# EAGLE design 32u4_macropad (EAGLE 9.6.2)
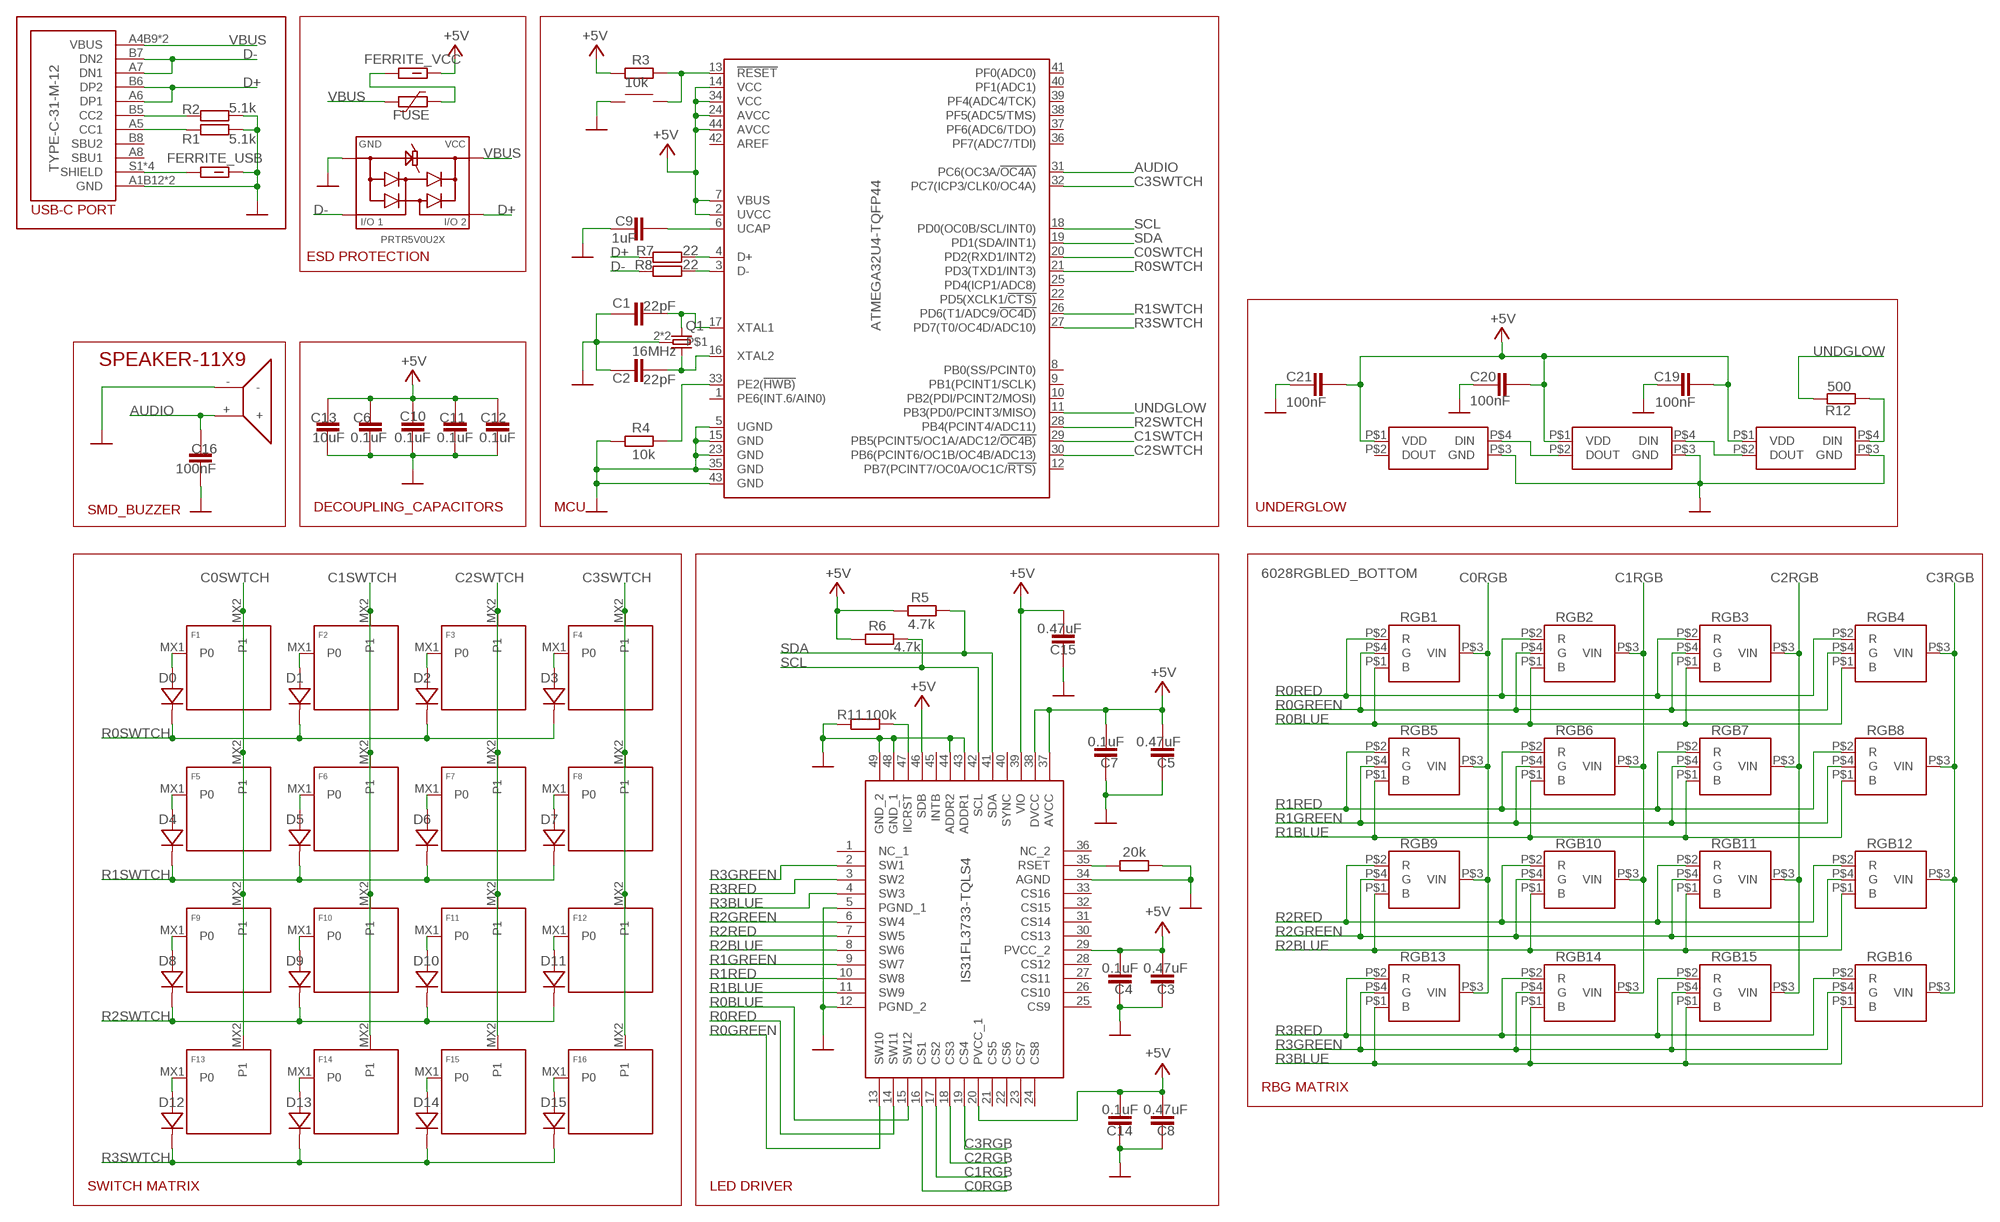
[diagram p0: schematic, sheet 1]

## Parts
C1  22pF  CAPACITOR-0603  [C0603]
C2  22pF  CAPACITOR-0603  [C0603]
C3  0.47uF  CAPACITOR-0603  [C0603]
C4  0.1uF  CAPACITOR-0603  [C0603]
C5  0.47uF  CAPACITOR-0603  [C0603]
C6  0.1uF  CAPACITOR-0603  [C0603]
C7  0.1uF  CAPACITOR-0603  [C0603]
C8  0.47uF  CAPACITOR-0603  [C0603]
C9  1uF  CAPACITOR-0603  [C0603]
C10  0.1uF  CAPACITOR-0603  [C0603]
C11  0.1uF  CAPACITOR-0603  [C0603]
C12  0.1uF  CAPACITOR-0603  [C0603]
C13  10uF  CAPACITOR-0603  [C0603]
C14  0.1uF  CAPACITOR-0603  [C0603]
C15  0.47uF  CAPACITOR-0603  [C0603]
C16  100nF  CAPACITOR-0603  [C0603]
C19  100nF  CAPACITOR-0603  [C0603]
C20  100nF  CAPACITOR-0603  [C0603]
C21  100nF  CAPACITOR-0603  [C0603]
D0  DIODE-SOD-123  [SOD-123]
D1  DIODE-SOD-123  [SOD-123]
D2  DIODE-SOD-123  [SOD-123]
D3  DIODE-SOD-123  [SOD-123]
D4  DIODE-SOD-123  [SOD-123]
D5  DIODE-SOD-123  [SOD-123]
D6  DIODE-SOD-123  [SOD-123]
D7  DIODE-SOD-123  [SOD-123]
D8  DIODE-SOD-123  [SOD-123]
D9  DIODE-SOD-123  [SOD-123]
D10  DIODE-SOD-123  [SOD-123]
D11  DIODE-SOD-123  [SOD-123]
D12  DIODE-SOD-123  [SOD-123]
D13  DIODE-SOD-123  [SOD-123]
D14  DIODE-SOD-123  [SOD-123]
D15  DIODE-SOD-123  [SOD-123]
DRIVER  IS31FL3733-TQLS4  [QFP50P900X900X120-49N]
F1  KEYSWITCH-PLAIN-MX-1U  [MX-1U]
F2  KEYSWITCH-PLAIN-MX-1U  [MX-1U]
F3  KEYSWITCH-PLAIN-MX-1U  [MX-1U]
F4  KEYSWITCH-PLAIN-MX-1U  [MX-1U]
F5  KEYSWITCH-PLAIN-MX-1U  [MX-1U]
F6  KEYSWITCH-PLAIN-MX-1U  [MX-1U]
F7  KEYSWITCH-PLAIN-MX-1U  [MX-1U]
F8  KEYSWITCH-PLAIN-MX-1U  [MX-1U]
F9  KEYSWITCH-PLAIN-MX-1U  [MX-1U]
F10  KEYSWITCH-PLAIN-MX-1U  [MX-1U]
F11  KEYSWITCH-PLAIN-MX-1U  [MX-1U]
F12  KEYSWITCH-PLAIN-MX-1U  [MX-1U]
F13  KEYSWITCH-PLAIN-MX-1U  [MX-1U]
F14  KEYSWITCH-PLAIN-MX-1U  [MX-1U]
F15  KEYSWITCH-PLAIN-MX-1U  [MX-1U]
F16  KEYSWITCH-PLAIN-MX-1U  [MX-1U]
FERRITE_USB  FERRITE_BEAD  FBCHIP-0603(1608-METRIC)  [BEADC1608X95N]
FERRITE_VCC  FERRITE_BEAD  FBCHIP-0603(1608-METRIC)  [BEADC1608X95N]
FUSE  0603L050  [0603L]
J1  TYPE-C-31-M-12  [HRO_TYPE-C-31-M-12]
MCU  ATMEGA32U4-TQFP44  MCU-ATMEGA32U4-AU(TQFP44)  [TQFP44-0.8-9.6X9.6MM]
Q1  16MHz  KX-5  [2.0X1.6_KX-5]
R1  5.1k  RESISTOR-0603  [R0603]
R2  5.1k  RESISTOR-0603  [R0603]
R3  10k  RESISTOR-0603  [R0603]
R4  10k  RESISTOR-0603  [R0603]
R5  4.7k  RESISTOR-0603  [R0603]
R6  4.7k  RESISTOR-0603  [R0603]
R7  22  RESISTOR-0603  [R0603]
R8  22  RESISTOR-0603  [R0603]
R11  100k  RESISTOR-0603  [R0603]
R12  500  RESISTOR-0603  [R0603]
RESET  20k  RESISTOR-0603  [R0603]
RGB1  6028RGBLED_BOTTOM  [6028RGBLED_BOTTOM]
RGB2  6028RGBLED_BOTTOM  [6028RGBLED_BOTTOM]
RGB3  6028RGBLED_BOTTOM  [6028RGBLED_BOTTOM]
RGB4  6028RGBLED_BOTTOM  [6028RGBLED_BOTTOM]
RGB5  6028RGBLED_BOTTOM  [6028RGBLED_BOTTOM]
RGB6  6028RGBLED_BOTTOM  [6028RGBLED_BOTTOM]
RGB7  6028RGBLED_BOTTOM  [6028RGBLED_BOTTOM]
RGB8  6028RGBLED_BOTTOM  [6028RGBLED_BOTTOM]
RGB9  6028RGBLED_BOTTOM  [6028RGBLED_BOTTOM]
RGB10  6028RGBLED_BOTTOM  [6028RGBLED_BOTTOM]
RGB11  6028RGBLED_BOTTOM  [6028RGBLED_BOTTOM]
RGB12  6028RGBLED_BOTTOM  [6028RGBLED_BOTTOM]
RGB13  6028RGBLED_BOTTOM  [6028RGBLED_BOTTOM]
RGB14  6028RGBLED_BOTTOM  [6028RGBLED_BOTTOM]
RGB15  6028RGBLED_BOTTOM  [6028RGBLED_BOTTOM]
RGB16  6028RGBLED_BOTTOM  [6028RGBLED_BOTTOM]
SP1  SPEAKER-11X9  SPEAKER-SMD-11X9  [AST1109MLTRQ]
SW2  SWITCH-SMD-EVP-BB2A9B00  [SWITCH-SMD-EVP-BB2A9B00]
U$1  PRTR5V0U2X  [PRTR5V0U2X]
UGLOW1  SK6812MINI-E  [SK6812MINI-E]
UGLOW2  SK6812MINI-E  [SK6812MINI-E]
UGLOW3  SK6812MINI-E  [SK6812MINI-E]

## Nets
AUDIO: C16.1 MCU.31(PC6(OC3A/!OC4A)) SP1.+
C0RGB: DRIVER.16(CS1) RGB1.P$3(VIN) RGB5.P$3(VIN) RGB9.P$3(VIN) RGB13.P$3(VIN)
C0SWTCH: F1.MX2(P1) F5.MX2(P1) F9.MX2(P1) F13.MX2(P1) MCU.20(PD2(RXD1/INT2))
C1RGB: DRIVER.17(CS2) RGB2.P$3(VIN) RGB6.P$3(VIN) RGB10.P$3(VIN) RGB14.P$3(VIN)
C1SWTCH: F2.MX2(P1) F6.MX2(P1) F10.MX2(P1) F14.MX2(P1) MCU.29(PB5(PCINT5/OC1A/ADC12/!OC4B))
C2RGB: DRIVER.18(CS3) RGB3.P$3(VIN) RGB7.P$3(VIN) RGB11.P$3(VIN) RGB15.P$3(VIN)
C2SWTCH: F3.MX2(P1) F7.MX2(P1) F11.MX2(P1) F15.MX2(P1) MCU.30(PB6(PCINT6/OC1B/OC4B/ADC13))
C3RGB: DRIVER.19(CS4) RGB4.P$3(VIN) RGB8.P$3(VIN) RGB12.P$3(VIN) RGB16.P$3(VIN)
C3SWTCH: F4.MX2(P1) F8.MX2(P1) F12.MX2(P1) F16.MX2(P1) MCU.32(PC7(ICP3/CLK0/OC4A))
D+: J1.A6(DP1) J1.B6(DP2) R7.1 U$1.3
D-: J1.A7(DN1) J1.B7(DN2) R8.1 U$1.2
GND: C1.1 C2.1 C3.1 C4.1 C5.1 C6.2 C7.1 C8.1 C9.1 C10.2 C11.2 C12.2 C13.2 C14.1 C15.1 C16.2 C19.1 C20.1 C21.1 DRIVER.5(PGND_1) DRIVER.12(PGND_2) DRIVER.34(AGND) DRIVER.43(ADDR1) DRIVER.44(ADDR2) DRIVER.48(GND_1) DRIVER.49(GND_2) FERRITE_USB.2 J1.A1B12(GND) J1.B1A12(GND) MCU.5(UGND) MCU.15(GND) MCU.23(GND) MCU.35(GND) MCU.43(GND) Q1.2 Q1.4 R1.1 R2.1 R4.1 R11.1 RESET.2 SP1.- SW2.A@1 SW2.A@2 U$1.1 UGLOW1.P$3(GND) UGLOW2.P$3(GND) UGLOW3.P$3(GND)
N$1: D0.A F1.MX1(P0)
N$2: FERRITE_VCC.1 FUSE.1
N$3: D1.A F2.MX1(P0)
N$4: D2.A F3.MX1(P0)
N$5: C2.2 MCU.16(XTAL2) Q1.3
N$6: MCU.3(D-) R8.2
N$7: R12.1 UGLOW3.P$4(DIN)
N$8: MCU.33(PE2(!HWB)) R4.2
N$9: D4.A F5.MX1(P0)
N$10: DRIVER.47(IICRST) R11.2
N$11: D5.A F6.MX1(P0)
N$12: D6.A F7.MX1(P0)
N$13: D9.A F10.MX1(P0)
N$15: MCU.4(D+) R7.2
N$17: MCU.13(!RESET) R3.2 SW2.B@3 SW2.B@4
N$20: C9.2 MCU.6(UCAP)
N$21: C1.2 MCU.17(XTAL1) Q1.1
N$23: D10.A F11.MX1(P0)
N$24: FERRITE_USB.1 J1.A5(CC1) J1.B5(CC2) J1.S1(SHIELD) J1.S2(SHIELD) J1.S3(SHIELD) J1.S4(SHIELD) R1.2 R2.2
N$25: UGLOW1.P$4(DIN) UGLOW2.P$2(DOUT)
N$26: DRIVER.35(RSET) RESET.1
N$28: D3.A F4.MX1(P0)
N$29: D7.A F8.MX1(P0)
N$30: D11.A F12.MX1(P0)
N$31: D13.A F14.MX1(P0)
N$32: D14.A F15.MX1(P0)
N$33: D12.A F13.MX1(P0)
N$34: D15.A F16.MX1(P0)
N$38: D8.A F9.MX1(P0)
N$39: UGLOW2.P$4(DIN) UGLOW3.P$2(DOUT)
R0BLUE: DRIVER.15(SW12) RGB1.P$1(B) RGB2.P$1(B) RGB3.P$1(B) RGB4.P$1(B)
R0GREEN: DRIVER.13(SW10) RGB1.P$4(G) RGB2.P$4(G) RGB3.P$4(G) RGB4.P$4(G)
R0RED: DRIVER.14(SW11) RGB1.P$2(R) RGB2.P$2(R) RGB3.P$2(R) RGB4.P$2(R)
R0SWTCH: D0.C D1.C D2.C D3.C MCU.21(PD3(TXD1/INT3))
R1BLUE: DRIVER.11(SW9) RGB5.P$1(B) RGB6.P$1(B) RGB7.P$1(B) RGB8.P$1(B)
R1GREEN: DRIVER.9(SW7) RGB5.P$4(G) RGB6.P$4(G) RGB7.P$4(G) RGB8.P$4(G)
R1RED: DRIVER.10(SW8) RGB5.P$2(R) RGB6.P$2(R) RGB7.P$2(R) RGB8.P$2(R)
R1SWTCH: D4.C D5.C D6.C D7.C MCU.26(PD6(T1/ADC9/!OC4D))
R2BLUE: DRIVER.8(SW6) RGB9.P$1(B) RGB10.P$1(B) RGB11.P$1(B) RGB12.P$1(B)
R2GREEN: DRIVER.6(SW4) RGB9.P$4(G) RGB10.P$4(G) RGB11.P$4(G) RGB12.P$4(G)
R2RED: DRIVER.7(SW5) RGB9.P$2(R) RGB10.P$2(R) RGB11.P$2(R) RGB12.P$2(R)
R2SWTCH: D8.C D9.C D10.C D11.C MCU.28(PB4(PCINT4/ADC11))
R3BLUE: DRIVER.4(SW3) RGB13.P$1(B) RGB14.P$1(B) RGB15.P$1(B) RGB16.P$1(B)
R3GREEN: DRIVER.2(SW1) RGB13.P$4(G) RGB14.P$4(G) RGB15.P$4(G) RGB16.P$4(G)
R3RED: DRIVER.3(SW2) RGB13.P$2(R) RGB14.P$2(R) RGB15.P$2(R) RGB16.P$2(R)
R3SWTCH: D12.C D13.C D14.C D15.C MCU.27(PD7(T0/OC4D/ADC10))
SCL: DRIVER.42(SCL) MCU.18(PD0(OC0B/SCL/INT0)) R6.1
SDA: DRIVER.41(SDA) MCU.19(PD1(SDA/INT1)) R5.1
UNDGLOW: MCU.11(PB3(PD0/PCINT3/MISO)) R12.2
VBUS: FUSE.2 J1.A4B9(VBUS) J1.B4A9(VBUS) U$1.4
VCC: C3.2 C4.2 C5.2 C6.1 C7.2 C8.2 C10.1 C11.1 C12.1 C13.1 C14.2 C15.2 C19.2 C20.2 C21.2 DRIVER.20(PVCC_1) DRIVER.29(PVCC_2) DRIVER.37(AVCC) DRIVER.38(DVCC) DRIVER.39(VIO) DRIVER.46(SDB) FERRITE_VCC.2 MCU.2(UVCC) MCU.7(VBUS) MCU.14(VCC) MCU.24(AVCC) MCU.34(VCC) MCU.44(AVCC) R3.1 R5.2 R6.2 UGLOW1.P$1(VDD) UGLOW2.P$1(VDD) UGLOW3.P$1(VDD) ; supply symbol labelled +5V
Unconnected: DRIVER.1(NC_1) DRIVER.21(CS5) DRIVER.22(CS6) DRIVER.23(CS7) DRIVER.24(CS8) DRIVER.25(CS9) DRIVER.26(CS10) DRIVER.27(CS11) DRIVER.28(CS12) DRIVER.30(CS13) DRIVER.31(CS14) DRIVER.32(CS15) DRIVER.33(CS16) DRIVER.36(NC_2) DRIVER.40(SYNC) DRIVER.45(INTB) J1.A8(SBU1) J1.B8(SBU2) MCU.1(PE6(INT.6/AIN0)) MCU.8(PB0(SS/PCINT0)) MCU.9(PB1(PCINT1/SCLK)) MCU.10(PB2(PDI/PCINT2/MOSI)) MCU.12(PB7(PCINT7/OC0A/OC1C/!RTS)) MCU.22(PD5(XCLK1/!CTS)) MCU.25(PD4(ICP1/ADC8)) MCU.36(PF7(ADC7/TDI)) MCU.37(PF6(ADC6/TDO)) MCU.38(PF5(ADC5/TMS)) MCU.39(PF4(ADC4/TCK)) MCU.40(PF1(ADC1)) MCU.41(PF0(ADC0)) MCU.42(AREF) UGLOW1.P$2(DOUT)

## Notes on the sheet
- USB-C PORT
- ESD PROTECTION
- SMD_BUZZER | DECOUPLING_CAPACITORS | MCU | UNDERGLOW
- RBG MATRIX
- SWITCH MATRIX | LED DRIVER

## Library data of the parts
C1-C16 C19-C21 = Components:CAPACITOR
D0 D1-D15 = Components:DIODE: Standard 1N4148 diode
DRIVER = IS31FL3733-TQLS4:IS31FL3733-TQLS4: LED Display Drivers 12x16 Dot Matrix LED Driver, eTQFP-48 (7.0mm x 7.0mm), Tray Source: Datasheet <https://mouser.componentsearchengine.com/Datasheets/1/IS31FL3733-TQLS4.pdf>; DESCRIPTION: LED Display Drivers 12x16 Dot Matrix LED Driver, eTQFP-48 (7.0mm x 7.0mm), Tray; HEIGHT: 1.2mm; MANUFACTURER_NAME: Integrated Silicon Solution Inc.; MANUFACTURER_PART_NUMBER: IS31FL3733-TQLS4; MOUSER_PART_NUMBER: 870-IS31FL3733-TQLS4; MOUSER_PRICE-STOCK: https://www.mouser.com/Search/Refine.aspx?Keyword=870-IS31FL3733-TQLS4
F1-F16 = Keyboard:KEYSWITCH-PLAIN
FERRITE_USB FERRITE_VCC = Filter:FB: Ferrite Bead - Generic; CATEGORY: Filter; SUB-CATEGORY: Ferrite bead
FUSE = polyfuse-smd_20:?: Polyfuse Resettable PTC Source: http://www.littelfuse.com/products/resettable-ptcs.aspx; MF: Littelfuse; MPN: 0603L050; OC_FARNELL: 2125904; OC_NEWARK: 88T7683
J1 = TYPE-C-31-M-12:TYPE-C-31-M-12: USB Connectors 24 Receptacle 1 8.94*7.3mm RoHS; AVAILABILITY: Unavailable; DESCRIPTION: USB Connectors 24 Receptacle 1 8.94*7.3mm RoHS; MF: HRO Electronics Co., Ltd.; MP: TYPE-C-31-M-12; PACKAGE: Package; PRICE: None
MCU = OPL_IC:MCU-ATMEGA32U4-AU(TQFP44): 310010010; MPN: ATMEGA32U4
Q1 = crystal-geyer_V1_0_NIC:KX: Quartz Crystals (MHz) SMD: KX - Serie Model Size l/w/h [mm] Frequency Range Frequency Stability Temp. Range [°C] Load Capacitance AECQ 200 availabel Datasheet KX-4 KX-5 KX-6 KX-7 KX-9A KX-9B KX-12A KX-12B KX-13 KX-20 KX-K KX-KS 1.6/1.2/0.3 2.0/1.6/0.45 2.5/2.0/0.55 3.2/2.5/0.8 5.0/3.2/1.0 5.0/3.2/1.1 6.0/3.5/1.1 6.0/3.5/1.0 7.0/5.0 /1.3 11.6/5.5/1.6 12.3/4.5/4.2 12.3/4.5/3.2 24.0 ~ 80.0 MHz 16.0 ~ 80.0 MHz 12.0 ~ 80.0 MHz 8.0 ~ 60.0 MHz 7,68 ~ 300,0 MHz 8,0 ~ 50,0 MHz 8,0 ~ 150,0 MHz 8,0 ~ 50,0 MHz 6,0 ~ 160,0 MHz 3,579 ~ 25,0 MHz 3,579 ~ 70,0 MHz 3,579 ~ 70,0 MHz ±10 … ±50ppm ±10 … ±50ppm ±10 … ±50ppm ±10 … ±50ppm ±10 … ±50ppm ±10 … ±50ppm ±10 … ±50ppm ±10 … ±50ppm ±10 … ±50ppm ±50ppm ±10 … ±50ppm ±10 … ±50ppm (*) -40°C …+85°C (*) -40°C …+125°C (*) -40°C …+125°C (*) -40°C …+125°C (*) -40°C …+105°C (*) -40°C …+105°C (*) -40°C …+125°C (*) -40°C …+105°C (*) -40°C …+105°C (*) -40°C …+105°C (*) -40°C …+85°C (*) -40°C …+85°C 8, 8…16 8, 8…16 10, 8…16 12, 7…20 16, 10…20 16, 10…20 16, 10…20 16, 12…20 16, 12…20 16, 12…20 16, 12…30 16, 12…30 - yes yes yes - - - - - - - - KX-4.pdf <http://www.geyer-electronic.de/uploads/tx_userartikelfrequenz/GEYER-KX-4.pdf> KX-5.pdf <http://www.geyer-electronic.de/uploads/tx_userartikelfrequenz/GEYER-KX-5.pdf> KX-6.pdf <http://www.geyer-electronic.de/uploads/tx_userartikelfrequenz/GEYER-KX-6.pdf> KX-7.pdf <http://www.geyer-electronic.de/uploads/tx_userartikelfrequenz/GEYER-KX-7.pdf> KX-9A.pdf <http://www.geyer-electronic.de/uploads/tx_userartikelfrequenz/GEYER-KX-9A.pdf> KX-9B.pdf <http://www.geyer-electronic.de/uploads/tx_userartikelfrequenz/GEYER-KX-9B.pdf> KX-12A.pdf <http://www.geyer-electronic.de/uploads/tx_userartikelfrequenz/GEYER-KX-12A.pdf> KX-12B.pdf <http://www.geyer-electronic.de/uploads/tx_userartikelfrequenz/GEYER-KX-12B.pdf> KX-13.pdf <http://www.geyer-electronic.de/uploads/tx_userartikelfrequenz/GEYER-KX-13.pdf> KX-20.pdf <http://www.geyer-electronic.de/uploads/tx_userartikelfrequenz/GEYER-KX-20.pdf> KX-K.pdf <http://www.geyer-electronic.de/uploads/tx_userartikelfrequenz/GEYER-KX-K.pdf> KX-KS.pdf <http://www.geyer-electronic.de/uploads/tx_userartikelfrequenz/GEYER-KX-KS.pdf> <http://www.geyer-electronic.de/fileadmin/template/img/logo-geyer-electronic.png> Details see: http://www.geyer-electronic.de/Frequenz-Produkte.9.0.html Created 2016-06-07, Hans Locher 2016 (C) Geyer Quartz Technology KX4,KX5,KX6,KX7,KX9A,KX9B,KX12A,KX12B,KX13,KX20,KXK,KXKS;1612;2016;2520;3225;5032;6035;7050;11655;12345;1,6x1,2;2,0x1,6;2,5x2,0;3,2x2,5;5,0x3,2;6,0x3,5;7,0x5,0;11,6x5,5;12,3x4,5;12,3x4,5;1.6x1.2;2.0x1.6;2.5x2.0;3.2x2.5;5.0x3.2;6.0x3.5;7.0x5.0;11.6x5.5;12.3x4.5;12.3x4.5;
R1-R8 R11 R12 RESET = Components:RESISTOR
RGB1-RGB16 = 6028LED:6028RGBLED
SP1 = Controller:SPEAKER
SW2 = Controller:SWITCH-SMD
U$1 = Controller:PRTR5V0U2X
UGLOW1-UGLOW3 = SK6812MINI-E:SK6812MINI-E

## Board
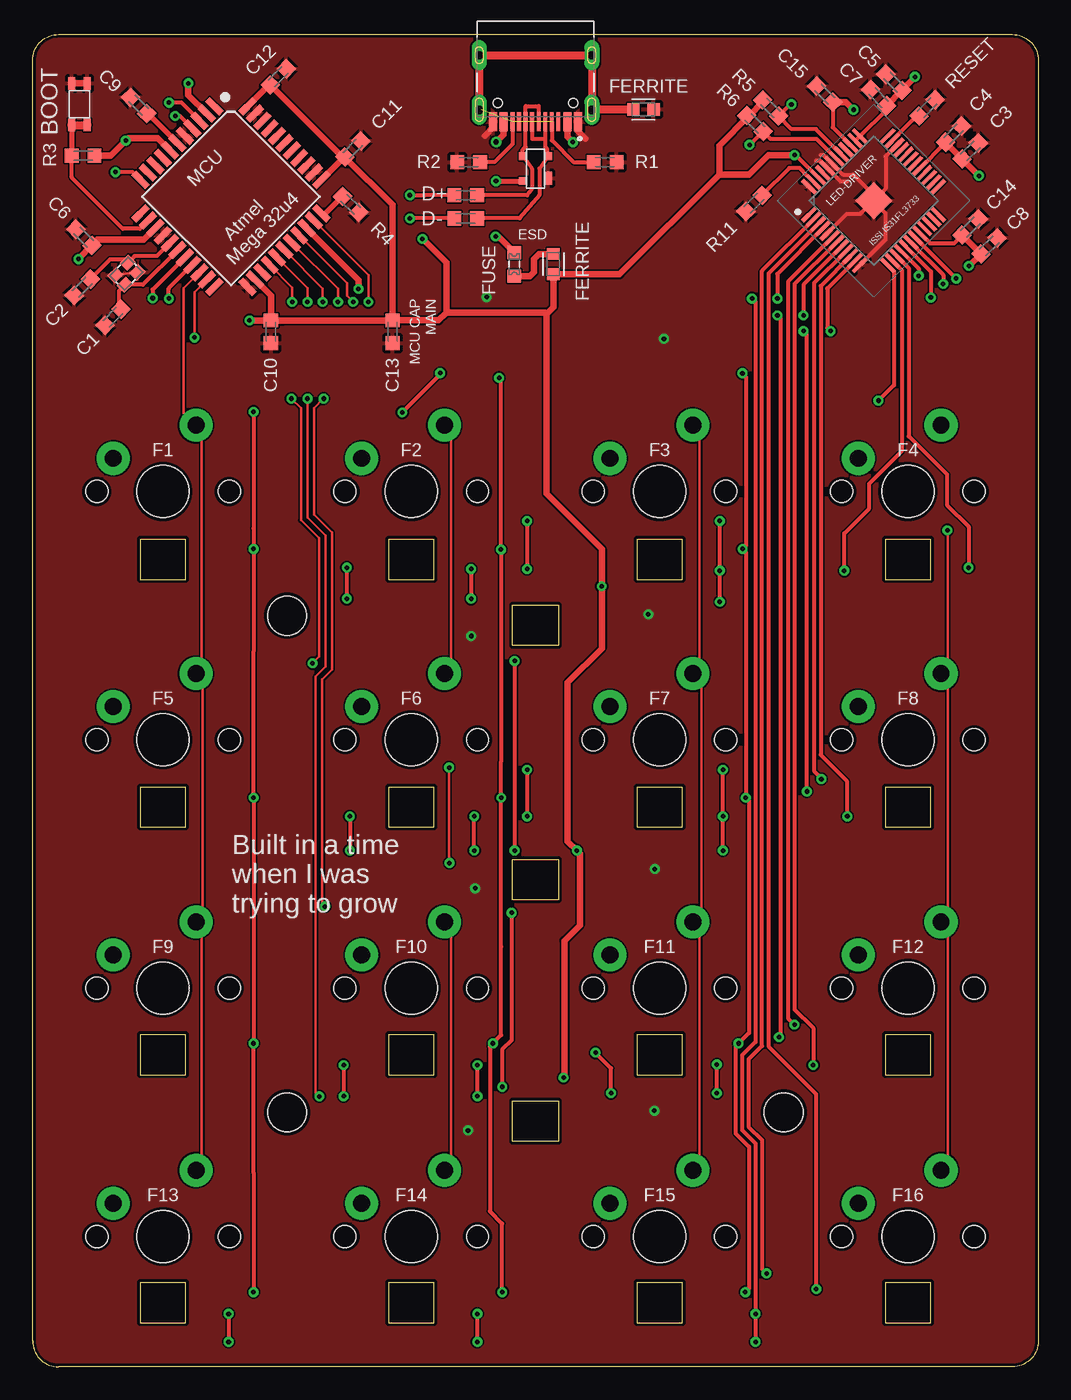
[diagram p1: board, top side]
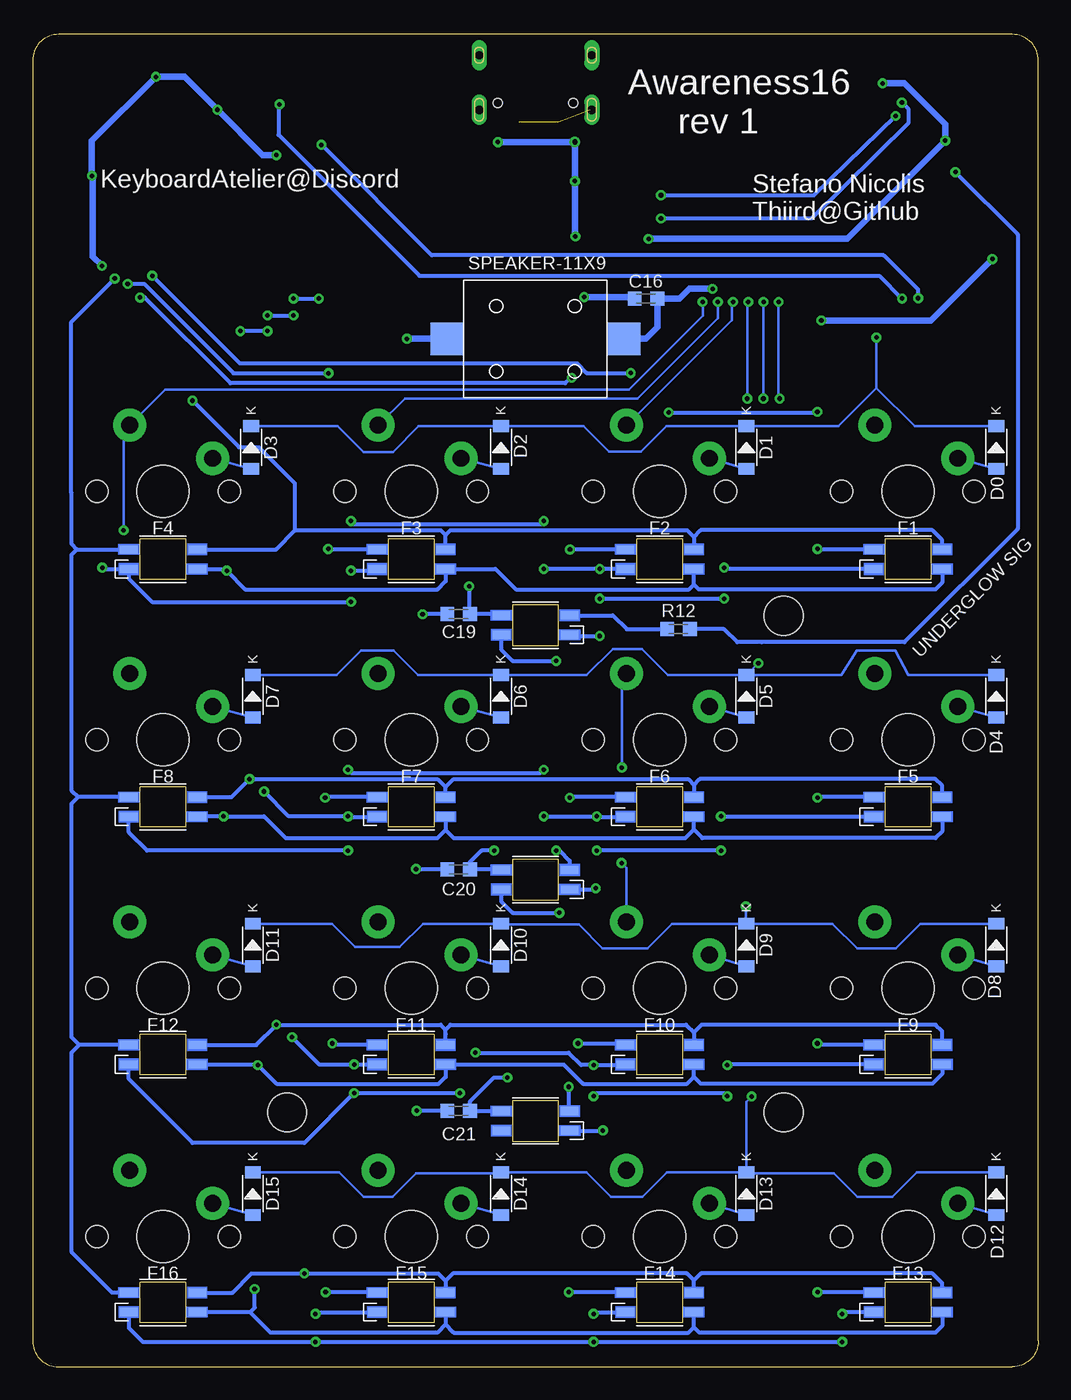
[diagram p2: board, bottom side, seen from below]

Size 77.15 x 102.2 mm. Coordinates in mm from the lower left corner, seen from the top.
Outline: 0,2 arc90 2,0 75.15,0 arc90 77.15,2 77.15,100.2 arc90 75.15,102.2 2,102.2 arc90 0,100.2 0,2
Copper layers (1*16): Top 0.035mm / dielectric 1.53mm / Bottom 0.035mm
Design rules "default *": minimum track width 6mil, minimum drill 0.35mm, track to track 5mil, track to pad 6mil, pad to pad 6mil, via to via 6mil, smd to smd 6mil, copper to edge 10mil, drill to drill 6mil, minimum pad ring 10mil, minimum via ring 8mil, stop-mask expansion 4mil, vias tented up to drill 0mil, thermal gap 10mil
Holes 3 mm at 57.62,19.52 19.52,19.52 19.52,57.62

### Footprints (pad centres in the part's own frame; a part is rotated, then mirrored left to right if it is on the bottom)
C0603 = smd 1.05 x 1.08: 1 -0.875,0; 2 0.875,0
SOD-123 = smd 0.91 x 1.22: A -1.635,0; C 1.635,0
QFP50P900X900X120-49N = smd 1.475 x 0.3: 1 -4.238,2.75; 2 -4.238,2.25; 3 -4.238,1.75; 4 -4.238,1.25; 5 -4.238,0.75; 6 -4.238,0.25; 7 -4.238,-0.25; 8 -4.238,-0.75; 9 -4.238,-1.25; 10 -4.238,-1.75; 11 -4.238,-2.25; 12 -4.238,-2.75; 25 4.238,-2.75; 26 4.238,-2.25; 27 4.238,-1.75; 28 4.238,-1.25; 29 4.238,-0.75; 30 4.238,-0.25; 31 4.238,0.25; 32 4.238,0.75; 33 4.238,1.25; 34 4.238,1.75; 35 4.238,2.25; 36 4.238,2.75 | smd 0.3 x 1.475: 13 -2.75,-4.238; 14 -2.25,-4.238; 15 -1.75,-4.238; 16 -1.25,-4.238; 17 -0.75,-4.238; 18 -0.25,-4.238; 19 0.25,-4.238; 20 0.75,-4.238; 21 1.25,-4.238; 22 1.75,-4.238; 23 2.25,-4.238; 24 2.75,-4.238; 37 2.75,4.238; 38 2.25,4.238; 39 1.75,4.238; 40 1.25,4.238; 41 0.75,4.238; 42 0.25,4.238; 43 -0.25,4.238; 44 -0.75,4.238; 45 -1.25,4.238; 46 -1.75,4.238; 47 -2.25,4.238; 48 -2.75,4.238 | smd 2 x 2: 49 0,0
MX-1U = drill 1.3 pad 2.54: MX1 -3.81,2.54; MX2 2.54,5.08 | hole 4: 0,0 | hole 1.7: -5.08,0; 5.08,0
BEADC1608X95N = smd 0.9 x 0.97: 1 -0.785,0 | smd 0.933 x 0.97: 2 0.769,0
0603L = smd 1 x 1: 1 -0.9,0; 2 0.9,0
HRO_TYPE-C-31-M-12 = smd 0.6 x 1.45: A1B12 -3.25,5.095; A4B9 -2.45,5.095; B1A12 3.25,5.095; B4A9 2.45,5.095 | smd 0.3 x 1.45: A5 -1.25,5.095; A6 -0.25,5.095; A7 0.25,5.095; A8 1.25,5.095; B5 1.75,5.095; B6 0.75,5.095; B7 -0.75,5.095; B8 -1.75,5.095 | drill 0.65 pad 1.05 long: S1 -4.32,4.18; S2 4.32,4.18; S3 -4.32,0; S4 4.32,0 | hole 0.7: -2.89,3.65; 2.89,3.65
TQFP44-0.8-9.6X9.6MM = smd 1.5 x 0.5: 1 -5.8,4; 2 -5.8,3.2; 3 -5.8,2.4; 4 -5.8,1.6; 5 -5.8,0.8; 6 -5.8,0; 7 -5.8,-0.8; 8 -5.8,-1.6; 9 -5.8,-2.4; 10 -5.8,-3.2; 11 -5.8,-4; 23 5.8,-4; 24 5.8,-3.2; 25 5.8,-2.4; 26 5.8,-1.6; 27 5.8,-0.8; 28 5.8,0; 29 5.8,0.8; 30 5.8,1.6; 31 5.8,2.4; 32 5.8,3.2; 33 5.8,4 | smd 0.5 x 1.5: 12 -4,-5.8; 13 -3.2,-5.8; 14 -2.4,-5.8; 15 -1.6,-5.8; 16 -0.8,-5.8; 17 0,-5.8; 18 0.8,-5.8; 19 1.6,-5.8; 20 2.4,-5.8; 21 3.2,-5.8; 22 4,-5.8; 34 4,5.8; 35 3.2,5.8; 36 2.4,5.8; 37 1.6,5.8; 38 0.8,5.8; 39 0,5.8; 40 -0.8,5.8; 41 -1.6,5.8; 42 -2.4,5.8; 43 -3.2,5.8; 44 -4,5.8
2.0X1.6_KX-5 = smd 0.95 x 0.8: 1 -0.675,-0.525; 2 0.675,-0.525; 3 0.675,0.525; 4 -0.675,0.525
R0603 = smd 1.05 x 1.08: 1 -0.875,0; 2 0.875,0
6028RGBLED_BOTTOM = smd 1.35 x 0.635 bottom: P$1 2.628,-0.75; P$2 -2.628,-0.75; P$3 2.628,0.75; P$4 -2.628,0.75
AST1109MLTRQ = smd 2.5 x 2.5: + 6.8,0; - -6.8,0
SWITCH-SMD-EVP-BB2A9B00 = smd 0.95 x 0.55: A@1 -1.6,0.6; A@2 -1.6,-0.6; B@3 1.6,0.6; B@4 1.6,-0.6
PRTR5V0U2X = smd 1 x 0.6: 1 -0.75,-0.95 | smd 0.6 x 0.6: 2 0.95,-0.95; 3 0.95,0.95; 4 -0.95,0.95
SK6812MINI-E = smd 1.35 x 0.635: P$1 -2.628,0.75; P$2 -2.628,-0.75; P$3 2.628,-0.75; P$4 2.628,0.75

### Placement (x,y rotation side)
C1  6.16,80.52 45 top
C2  3.82,82.82 45 top
C3  71.93,93.27 225 top
C4  70.64,94.55 225 top
C5  66.08,98.53 315 top
C6  3.93,86.65 135 top
C7  64.9,97.35 315 top
C8  73.38,85.98 225 top
C9  8.13,96.76 315 top
C10  18.28,79.39 270 top
C11  24.57,93.41 45 top
C12  18.85,98.96 45 top
C13  27.61,79.4 270 top
C14  71.93,87.43 225 top
C15  60.77,97.63 315 top
C16  30.09,81.93 180 bottom
C19  44.47,57.74 0 bottom
C20  44.47,38.15 0 bottom
C21  44.47,19.65 0 bottom
D0  3.24,70.51 90 bottom
D1  22.4,70.51 90 bottom
D2  41.23,70.51 90 bottom
D3  60.39,70.51 90 bottom
D4  3.24,51.44 90 bottom
D5  22.4,51.44 90 bottom
D6  41.23,51.44 90 bottom
D7  60.25,51.44 90 bottom
D8  3.24,32.36 90 bottom
D9  22.4,32.36 90 bottom
D10  41.23,32.36 90 bottom
D11  60.25,32.36 90 bottom
D12  3.24,13.28 90 bottom
D13  22.4,13.28 90 bottom
D14  41.23,13.28 90 bottom
D15  60.25,13.28 90 bottom
DRIVER  64.52,89.46 45 top
F1  10,67.15 0 top
F2  29.05,67.15 0 top
F3  48.1,67.15 0 top
F4  67.15,67.15 0 top
F5  10,48.1 0 top
F6  29.05,48.1 0 top
F7  48.1,48.1 0 top
F8  67.15,48.1 0 top
F9  10,29.05 0 top
F10  29.05,29.05 0 top
F11  48.1,29.05 0 top
F12  67.15,29.05 0 top
F13  10,10 0 top
F14  29.05,10 0 top
F15  48.1,10 0 top
F16  67.15,10 0 top
FERRITE_USB  46.87,96.45 0 top
FERRITE_VCC  39.95,84.57 270 top
FUSE  36.95,84.57 90 top
J1  38.58,100.61 180 top
MCU  15.21,89.76 315 top
Q1  7.19,83.85 45 top
R1  43.92,92.41 180 top
R2  33.45,92.41 0 top
R3  3.88,92.9 180 top
R4  24.4,89.16 135 top
R5  56.61,96.57 135 top
R6  55.42,95.37 135.9 top
R7  33.21,89.87 180 top
R8  33.21,88.09 180 top
R11  55.34,89.25 45 top
R12  27.6,56.59 0 bottom
RESET  68.62,96.57 45 top
RGB1  10,61.95 0 top
RGB2  29.05,61.95 0 top
RGB3  48.1,61.95 0 top
RGB4  67.15,61.95 0 top
RGB5  10,42.95 0 top
RGB6  29.05,42.95 0 top
RGB7  48.1,42.95 0 top
RGB8  67.15,42.95 0 top
RGB9  10,23.95 0 top
RGB10  29.05,23.95 0 top
RGB11  48.1,23.95 0 top
RGB12  67.15,23.95 0 top
RGB13  10,4.95 0 top
RGB14  29.05,4.95 0 top
RGB15  48.1,4.95 0 top
RGB16  67.15,4.95 0 top
SP1  38.58,78.86 0 bottom
SW2  3.6,96.85 270 top
U$1  38.58,91.91 90 top
UGLOW1  38.58,18.87 0 bottom
UGLOW2  38.58,37.37 0 bottom
UGLOW3  38.58,56.9 0 bottom

### Tracks (layer width: path | path; a pad name or v marks a point on that pad's centre or on a via)
AUDIO  (via drill 0.35)
  Top 0.5: v25,82.69 25,83.37 MCU.31
  Bottom 0.5: v25,82.69 26.78,82.69 27.54,81.93 C16.1 29.21,79.75 30.11,78.86 SP1.+
C0RGB  (via drill 0.35)
  Top 0.3: v16.95,73.26 16.95,64.33 v16.95,62.74 16.95,54.87 v16.95,43.66 v16.95,43.65 v16.95,24.82 16.95,14.89 v16.95,5.74 | v31.27,76.23 31.27,76.12 v28.36,73.21 | DRIVER.16 67.97,84.24 v67.97,83.69
  Bottom 0.3: v67.97,83.69 61.26,76.97 35.38,76.97 34.65,76.23 v31.27,76.23 | v28.36,73.21 17,73.21 v16.95,73.26 | RGB13.P$3 12.66,5.74 v16.95,5.74 | RGB9.P$3 16.83,24.7 v16.95,24.82 | RGB5.P$3 16.9,43.7 v16.95,43.66 | v16.95,62.74 12.67,62.74 RGB1.P$3
C0SWTCH
  Top 0.2: F13.MX2 12.95,15.49 12.95,33.72 F9.MX2 13.04,34.63 13.04,52.68 F5.MX2 12.95,53.59 12.95,71.82 F1.MX2 11.6,73.17 11.6,82.75 12.31,83.46 MCU.20
C1RGB  (via drill 0.35)
  Top 0.3: DRIVER.17 68.9,84.01 v68.9,82.02 | v36.03,5.74 36.03,10.98 35.07,11.94 35.07,24.58 v35.31,24.82 35.95,25.46 35.95,32.23 v35.95,43.66 35.95,46.45 35.95,62.62 v35.93,62.7 35.93,75.72 v35.79,75.86
  Bottom 0.3: v68.9,82.02 68.54,82.02 61.97,75.45 36.3,75.45 35.89,75.86 v35.79,75.86 | RGB14.P$3 31.71,5.74 v36.03,5.74 | v35.31,24.82 31.79,24.82 RGB10.P$3 | RGB6.P$3 35.91,43.7 v35.95,43.66 | RGB2.P$3 35.87,62.7 v35.93,62.7
C1SWTCH  (via drill 0.35)
  Top 0.2: F2.MX2 32.09,71.73 32.09,53.68 F6.MX2 | F14.MX2 32.09,15.58 32.09,33.63 F10.MX2 | v23.42,81.69 23.42,82.69 MCU.29 | v31.97,38.65 31.95,38.67 v31.95,45.97
  Bottom 0.2: v23.42,81.69 23.49,81.62 23.49,80.3 31.57,72.23 F2.MX2 | F6.MX2 31.95,52.82 v31.95,45.97 | F10.MX2 31.59,38.27 v31.97,38.65
C2RGB  (via drill 0.35)
  Top 0.3: v54.45,76.21 54.71,75.95 54.71,62.98 v54.47,62.74 54.71,62.5 v54.71,43.66 54.95,43.42 54.95,25.61 v54.15,24.82 53.93,24.59 53.93,17.9 54.95,16.88 54.95,6.01 v54.67,5.74 | DRIVER.18 69.86,83.77 v69.86,83.07
  Bottom 0.3: v54.45,76.21 61.73,76.21 68.6,83.07 69.62,83.07 v69.86,83.07 | RGB15.P$3 50.77,5.74 v54.67,5.74 | RGB11.P$3 54.04,24.7 v54.15,24.82 | RGB7.P$3 54.67,43.7 v54.71,43.66 | RGB3.P$3 54.43,62.7 v54.47,62.74
C2SWTCH  (via drill 0.35)
  Top 0.2: F15.MX2 51.14,15.58 51.14,33.63 F11.MX2 51.29,34.78 51.29,52.53 F7.MX2 51.14,53.68 51.14,71.73 F3.MX2 | v24.59,81.69 24.11,82.17 24.11,83.13 MCU.30
  Bottom 0.2: v24.59,81.69 24.59,80.45 30.76,74.28 48.59,74.28 F3.MX2
C3RGB  (via drill 0.35)
  Top 0.3: DRIVER.19 v70.85,83.48
  Bottom 0.3: RGB16.P$3 71.05,5.7 74.19,8.84 74.19,24.1 73.59,24.7 | RGB12.P$3 73.59,24.7 | RGB8.P$3 73.67,43.7 | 73.59,24.7 74.19,25.3 74.19,43.18 73.67,43.7 | 73.75,62.7 RGB4.P$3 | 73.67,43.7 74.19,44.22 74.19,62.26 73.75,62.7 | v70.85,83.48 74.19,80.14 74.19,67.03 74.19,63.14 73.75,62.7
C3SWTCH  (via drill 0.35)
  Top 0.2: F16.MX2 70.19,15.58 70.19,33.63 F12.MX2 70.19,34.63 70.19,52.68 F8.MX2 70.21,53.7 70.21,64.13 v70.17,64.17 | MCU.32 25.76,83.74 v25.76,81.69
  Bottom 0.2: v25.76,81.69 25.73,81.67 25.73,80.63 31.42,74.95 66.97,74.95 F4.MX2 70.17,71.75 v70.17,64.18 v70.17,64.17
D+
  Top 0.3: J1.A6 38.83,96.71 37.83,96.71 J1.B6 37.83,93.58 37.6,93.36 U$1.3 38.3,91.91 38.3,90.35 37.94,89.87 R7.1
D-
  Top 0.3: J1.B7 39.33,94.19 | 39.33,94.19 39.33,93.95 39.33,93.57 39.45,93.45 39.45,92.91 U$1.2 38.87,91.91 38.87,89.86 37.36,88.09 R8.1 | J1.A7 38.33,94.19 39.33,94.19
GND  (via drill 0.35)
  Top 0.2: Q1.2 Q1.4
  Top 0.3: C15.1 59.97,98.42 | 62.49,90.92 61.99,90.92 DRIVER.44 60.42,92.5 60.1,92.5 | DRIVER.34 65.45,92.86 65.45,90.39 64.73,89.67 | 64.73,89.67 DRIVER.49 64.48,89.42 | DRIVER.5 62.45,88.45 63.51,88.45 64.48,89.42 | DRIVER.12 65.45,86.5 65.45,88.45 64.48,89.42 | 64.73,89.67 62.95,91.45 62.17,91.45 61.56,92.06 DRIVER.43 60.67,92.95 60.45,92.95
  Top 0.5: SW2.A@2 SW2.A@1 | 42.41,94.21 41.83,94.8 J1.A1B12 | J1.B1A12 35.33,95.09 34.69,94.45
  Bottom 0.3: C20.1 47.7,38.15 v47.73,38.19 | C21.1 47.63,19.65 v47.69,19.65 | UGLOW2.P$3 34.04,36.62 v33.95,36.71 | C19.1 45.36,57.73 v47.24,57.73 | UGLOW3.P$3 35.86,56.06 v33.64,56.06 | UGLOW1.P$3 33.42,18.12 v33.4,18.14
  Bottom 0.5: C16.2 31.09,82.06 v34.83,82.06 | SP1.- 48.28,78.86 v48.43,78.86
  pour Top: -9.05,105.25 -9.05,-9.05 86.2,-9.05 86.2,105.25
N$1
  Bottom 0.2: D0.A F1.MX1
N$2
  Top 0.5: FUSE.1 38.17,83.67 38.45,83.95 38.45,84.95 38.86,85.36 FERRITE_VCC.1
N$3
  Bottom 0.2: D1.A F2.MX1
N$4
  Bottom 0.2: D2.A F3.MX1
N$5
  Top 0.3: MCU.16 9.53,85.21 7.81,85.21 Q1.3 7.04,84.95 5.95,84.95 5.45,84.45 C2.2
N$6  (via drill 0.35)
  Top 0.3: R8.2 v28.95,88.09 | MCU.3 12.81,95.59 11.43,96.97 v10.47,96.97
  Bottom 0.3: v28.95,88.09 17.38,88.09 9.95,95.45 9.95,96.45 v10.47,96.97
N$7
  Bottom 0.3: UGLOW3.P$4 32.64,57.65 31.57,56.59 R12.1
N$8
  Top 0.4: MCU.33 22.49,88.49 R4.2
N$9
  Bottom 0.2: D4.A F5.MX1
N$10
  Top 0.3: R11.2 58.04,91.95 58.84,91.95 59.45,91.34 DRIVER.47
N$11
  Bottom 0.2: D5.A F6.MX1
N$12
  Bottom 0.2: D6.A F7.MX1
N$13
  Bottom 0.2: D9.A F10.MX1
N$15  (via drill 0.35)
  Top 0.3: R7.2 30.1,89.87 v28.95,89.87 | MCU.4 11.29,95.95 v10.95,95.95
  Bottom 0.3: v28.95,89.87 17.22,89.87 v10.95,95.95
N$17
  Top 0.3: SW2.B@4 3,95.03 | 3,92.65 R3.2 3,91.23 6.93,87.3 8.23,87.3 MCU.13
  Top 0.4: 3,95.03 3,92.65
  Top 0.6: SW2.B@4 SW2.B@3
N$20
  Top 0.4: C9.2 8.83,96.14 MCU.6
N$21
  Top 0.3: MCU.17 8.45,83 Q1.1 6.61,82.52 6.61,81.31 C1.2
N$23
  Bottom 0.2: D10.A F11.MX1
N$24  (2 unrouted)
  Top 0.3: 34.41,96.43 J1.S2 | 42.74,96.43 J1.S1 | J1.A5 39.83,94.07 41.49,92.41 R1.2 | J1.B5 36.83,93.8 35.43,92.41 R2.2
  Top 0.5: FERRITE_USB.1 46.06,96.43
  Top 0.6: J1.S2 J1.S4 J1.S3 J1.S1 46.06,96.43
N$25  (via drill 0.35)
  Top 0.3: v36.74,34.83 36.74,25.05 36.03,24.34 v36.03,21.48
  Bottom 0.3: UGLOW2.P$2 41.2,35.72 40.32,34.83 v36.74,34.83 | v36.03,21.48 36.03,19.7 UGLOW1.P$4
N$26
  Top 0.3: DRIVER.35 67.84,95.96 RESET.1
N$28
  Bottom 0.2: D3.A F4.MX1
N$29
  Bottom 0.2: D7.A F8.MX1
N$30
  Bottom 0.2: D11.A F12.MX1
N$31
  Bottom 0.2: D13.A F14.MX1
N$32
  Bottom 0.2: D14.A F15.MX1
N$33
  Bottom 0.2: D12.A F13.MX1
N$34
  Bottom 0.2: D15.A F16.MX1
N$38
  Bottom 0.2: D8.A F9.MX1
N$39  (via drill 0.35)
  Top 0.3: v36.98,54.15 v36.98,39.6
  Bottom 0.3: UGLOW3.P$2 41.2,55.04 40.32,54.15 v36.98,54.15 | v36.98,39.6 36.74,39.6 35.95,38.81 UGLOW2.P$4
R0BLUE  (via drill 0.35)
  Top 0.3: DRIVER.15 67.21,84.29 67.21,71.38 70.13,68.46 70.13,66.12 71.8,64.45 v71.8,61.31 | v52.72,58.68 v52.72,61.07 v52.72,64.88 | v24.1,61.31 v24.1,58.92 | v37.93,64.88 v37.93,61.2 | v33.64,61.2 v33.64,58.92
  Bottom 0.3: RGB1.P$1 23.99,61.2 v24.1,61.31 | v52.72,58.68 67.98,58.68 69.78,60.48 RGB4.P$1 71.69,61.2 v71.8,61.31 | v52.72,61.07 50.86,61.07 RGB3.P$1 | v33.64,58.92 v24.1,58.92 | v37.93,64.88 38.17,64.65 52.48,64.65 v52.72,64.88 | RGB2.P$1 33.53,61.2 v33.64,61.2 v37.93,61.2
R0GREEN  (via drill 0.35)
  Top 0.3: DRIVER.13 66.07,84.01 66.07,75.3 v64.89,74.11
  Bottom 0.3: RGB1.P$4 7.37,63.42 8.12,64.17 25.91,64.17 26.42,63.65 | 26.42,63.65 RGB2.P$4 | RGB3.P$4 45.47,63.79 | 45.47,63.79 45.09,64.17 26.94,64.17 26.42,63.65 | RGB4.P$4 58.48,62.7 57.01,64.17 | 57.01,64.17 56.78,64.17 45.85,64.17 45.47,63.79 | 57.01,64.17 57.01,67.75 59.8,70.54 61.31,70.54 v64.89,74.11
R0RED  (via drill 0.35)
  Top 0.3: DRIVER.14 66.71,84.08 66.71,70.29 64.17,67.75 64.17,65.84 62.26,63.93 v62.26,61.07
  Bottom 0.3: RGB1.P$2 7.37,60.15 7.88,59.64 26.05,59.64 26.42,60.01 | 26.42,60.01 RGB2.P$2 | 26.42,60.01 26.79,59.64 40.08,59.64 41.64,61.2 RGB3.P$2 45.47,60.26 46.09,59.64 60.83,59.64 v62.26,61.07 62.39,61.2 RGB4.P$2
R0SWTCH  (via drill 0.35)
  Top 0.2: MCU.21 12.41,82.44 v12.41,78.96
  Bottom 0.2: D0.C 9.48,72.15 12.41,75.09 | D3.C 53.74,72.15 51.77,70.18 49.51,70.18 47.54,72.15 D2.C 34.89,72.15 32.95,70.21 30.47,70.21 28.53,72.15 D1.C 15.35,72.15 12.41,75.09 | v12.41,78.96 12.41,75.09
R1BLUE  (via drill 0.35)
  Top 0.3: DRIVER.11 60.95,82.7 60.95,79.71 v61.21,79.45 | v24.34,42.23 v24.34,39.6 | v33.88,39.6 v33.88,42.23 | v52.96,39.6 v52.96,42.23 v52.96,45.8 | v59.4,44.13 59.4,44.37 59.37,44.4 59.37,79.21 v59.13,79.45 | v37.93,45.8 v37.93,42.23
  Bottom 0.3: v59.13,79.45 v61.21,79.45 | RGB5.P$1 24.31,42.2 v24.34,42.23 | v24.34,39.6 v33.88,39.6 | RGB6.P$1 33.85,42.2 v33.88,42.23 v37.93,42.23 | RGB7.P$1 52.93,42.2 v52.96,42.23 57.49,42.23 v59.4,44.13 | v52.96,39.6 68.37,39.6 69.78,41.01 RGB8.P$1 | v52.96,45.8 52.72,45.57 38.17,45.57 v37.93,45.8
R1GREEN  (via drill 0.35)
  Top 0.3: DRIVER.9 59.95,83.12 59.95,45.71 60.51,45.15 v60.51,45.09
  Bottom 0.3: RGB5.P$4 7.37,44.58 7.88,45.09 25.99,45.09 26.42,44.65 | 26.42,44.65 RGB6.P$4 | RGB7.P$4 45.47,44.47 | 45.47,44.47 44.85,45.09 26.86,45.09 26.42,44.65 | RGB8.P$4 61.9,43.7 v60.51,45.09 46.09,45.09 45.47,44.47
R1RED  (via drill 0.35)
  Top 0.3: DRIVER.10 60.45,82.91 60.45,46.94 62.5,44.89 v62.5,42.23
  Bottom 0.3: RGB5.P$2 7.37,41.07 7.88,40.56 25.77,40.56 26.42,41.21 | 26.42,41.21 RGB6.P$2 | RGB7.P$2 45.47,41.18 | 45.47,41.18 44.85,40.56 27.07,40.56 26.42,41.21 | 45.47,41.18 46.09,40.56 57.73,40.56 59.4,42.23 v62.5,42.23 64.49,42.23 RGB8.P$2
R1SWTCH  (via drill 0.35)
  Top 0.2: v19.92,81.69 19.92,82.79 MCU.26 | v19.85,74.27 20.59,73.53 20.59,64.95 21.97,63.56 21.97,54.47 v21.47,53.97
  Bottom 0.2: D4.C 9.98,53.07 10.97,54.95 13.93,54.95 15.1,53.07 D5.C | D5.C 28.42,53.07 30.42,55.07 32.65,55.07 34.65,53.07 D6.C 47.57,53.07 49.45,54.95 51.95,54.95 53.83,53.07 D7.C | D5.C 22.37,53.07 v21.47,53.97 | v19.92,81.69 19.94,81.67 19.94,74.36 v19.85,74.27
R2BLUE  (via drill 0.35)
  Top 0.3: DRIVER.8 59.13,83.01 v59.13,80.65 | v57.13,80.65 57.37,80.41 57.37,25.42 v57.25,25.3 v57.25,25.29 | v23.86,23.15 v23.86,20.76 | v34.12,20.76 v34.12,23.15 | v44.37,21 44.37,22.91 v43.18,24.1 | v52.48,21 v52.48,23.2
  Bottom 0.3: v59.13,80.65 57.34,80.65 v57.13,80.65 | v57.25,25.29 55.16,23.2 v52.48,23.2 RGB11.P$1 | RGB9.P$1 23.81,23.2 v23.86,23.15 | v34.12,20.76 33.88,21 24.1,21 v23.86,20.76 | RGB10.P$1 31.73,23.15 v34.12,23.15 35.07,23.15 36.03,24.1 v43.18,24.1 | v44.37,21 v52.48,21 56.3,17.18 64.89,17.18 69.78,22.08 RGB12.P$1
R2GREEN  (via drill 0.35)
  Top 0.3: DRIVER.6 57.95,83.24 57.95,26.74 v58.45,26.25
  Bottom 0.3: RGB9.P$4 7.37,25.74 7.88,26.25 25.83,26.25 26.42,25.65 | 26.42,25.65 RGB10.P$4 | RGB11.P$4 45.47,25.53 45.47,25.87 | 45.47,25.87 45.09,26.25 27.02,26.25 26.42,25.65 | RGB12.P$4 59.99,24.7 v58.45,26.24 v58.45,26.25 45.85,26.25 45.47,25.87
R2RED  (via drill 0.35)
  Top 0.3: DRIVER.7 58.45,83.03 58.45,27.44 59.88,26.01 v59.88,23.15
  Bottom 0.3: RGB9.P$2 7.37,22.47 8.12,21.72 25.89,21.72 26.42,22.25 | 26.42,22.25 RGB10.P$2 | 26.42,22.25 26.95,21.72 34.92,21.72 36.41,23.2 RGB11.P$2 45.47,22.25 46,21.72 58.45,21.72 v59.88,23.15 59.93,23.2 RGB12.P$2
R2SWTCH  (via drill 0.35)
  Top 0.2: v22.33,74.27 22.3,74.27 21.59,73.55 21.59,65.39 22.97,64 22.97,53.47 22.21,52.71 22.21,48.34 22.21,35.53 v22.43,35.31 | v22.25,81.69 22.25,82.72 MCU.28
  Bottom 0.2: D8.C 9.05,34 10.95,32.11 13.9,32.11 15.79,34 D9.C | D9.C 28.1,34 30,32.11 33.42,32.11 35.25,33.93 41.09,33.93 41.16,34 D10.C 47.21,34 49,32.21 52.4,32.21 54.19,34 D11.C | v22.25,81.69 22.33,81.62 v22.33,74.27 | D9.C 22.44,34.04 22.43,34.05 v22.43,35.31
R3BLUE  (via drill 0.35)
  Top 0.3: v57.13,81.95 57.13,83.83 DRIVER.4 | v55.19,81.95 55.45,81.69 55.45,24.92 54.43,23.89 54.43,18.16 55.45,17.14 55.45,4.17 v55.45,4.07 v55.45,1.92 | v15.04,4.07 v15.04,1.92 | v34.12,1.92 v34.12,4.07
  Bottom 0.3: v57.13,81.95 v55.19,81.95 | RGB13.P$1 14.91,4.2 v15.04,4.07 | v15.04,1.92 v34.12,1.92 v55.45,1.92 68.7,1.92 69.78,3 RGB16.P$1 | v34.12,4.07 33.99,4.2 RGB14.P$1 | v55.45,4.07 55.21,4.2 RGB15.P$1
R3GREEN  (via drill 0.35)
  Top 0.3: DRIVER.2 55.95,84.07 55.95,24.62 54.93,23.6 54.93,18.43 55.95,17.4 55.95,7.52 v56.3,7.17
  Bottom 0.3: 45.47,6.6 46.04,7.17 v56.3,7.17 60.35,7.17 61.82,5.7 RGB16.P$4 | 45.47,6.6 RGB15.P$4 | RGB14.P$4 26.42,6.63 | 26.42,6.63 26.96,7.17 44.9,7.17 45.47,6.6 | RGB13.P$4 7.37,6.42 8.12,7.17 25.88,7.17 26.42,6.63
R3RED  (via drill 0.35)
  Top 0.3: DRIVER.3 56.45,83.86 56.45,24.59 60.12,20.92 v60.12,5.97
  Bottom 0.3: RGB13.P$2 7.37,3.15 7.88,2.64 26.01,2.64 26.42,3.05 | 26.42,3.05 RGB14.P$2 | RGB15.P$2 45.47,3.26 | 45.47,3.26 44.85,2.64 26.83,2.64 26.42,3.05 | 60.46,4.2 RGB16.P$2 | 60.46,4.2 60.12,4.54 v60.12,5.97 | 45.47,3.26 46.09,2.64 58.9,2.64 60.46,4.2
R3SWTCH  (via drill 0.35)
  Top 0.2: v21.09,81.69 21.09,82.76 MCU.27 | v21.09,74.27 21.09,74.03 21.09,65.15 22.47,63.77 22.47,53.71 21.71,52.95 21.71,21.03 v22,20.74
  Bottom 0.2: D12.C 9.32,14.92 11.18,13.06 13.9,13.06 15.67,14.83 22.31,14.83 D13.C | D13.C 28.5,14.92 30.36,13.06 32.78,13.06 34.64,14.92 D14.C 41.69,14.92 41.78,14.83 47.74,14.83 49.52,13.06 51.76,13.06 53.62,14.92 D15.C | D13.C 22.4,20.34 v22,20.74 | v21.09,74.27 v21.09,81.69
SCL  (via drill 0.35)
  Top 0.3: MCU.18 10.18,83.6 9.21,82.63 v9.21,81.97 | v55,93.73 55.02,93.73 R6.1 56.63,94.18 60.15,94.18 DRIVER.42
  Bottom 0.3: v55,93.73 v54.99,93.73 46.53,85.27 11.87,85.27 9.21,82.61 v9.21,81.97
SDA  (via drill 0.35)
  Top 0.3: v10.45,81.94 10.45,82.74 MCU.19 | v58.21,96.84 58.13,96.84 R5.1 57.23,95.91 58.21,94.94 60.1,94.94 DRIVER.41
  Bottom 0.3: v10.45,81.94 10.47,81.94 12.21,83.69 47.47,83.69 58.28,94.5 58.28,96.77 v58.21,96.84
UNDGLOW  (via drill 0.35)
  Top 0.3: MCU.11 7.67,91.65 v6.36,91.65
  Bottom 0.3: v6.36,91.65 1.59,86.88 1.59,64.26 10.27,55.58 21.24,55.58 23.1,55.58 24.1,56.59 R12.2
VBUS  (via drill 0.35, 0.4)
  Top 0.4: U$1.4 v35.55,90.95
  Top 0.5: v35.52,86.71 35.71,86.71 FUSE.2 | J1.B4A9 36.12,94.52 v35.55,93.95 | J1.A4B9 41.03,94.37 v41.45,93.95
  Bottom 0.5: v41.45,93.95 v35.55,93.95 35.55,91.05 v35.55,90.95 35.55,90.93 35.55,86.74 v35.52,86.71
VCC  (via drill 0.35)
  Top 0.3: 23.9,92.8 C11.1 | DRIVER.39 61.38,95.07 61.38,96.53 C15.2 | DRIVER.38 DRIVER.37 65.52,96.45 | v58.45,92.95 58.55,92.95 DRIVER.46 | DRIVER.20 68.85,86.19 70.69,86.19 C14.2 | DRIVER.29 70.02,93.9 C4.2
  Top 0.5: C4.2 C3.2 v72.6,91.36 | 65.52,96.45 C7.2 C5.2 67.69,98.91 v67.69,98.95 | R5.2 55.99,96.99 54.98,95.98 | R6.2 54.98,95.98 | v71.83,84.45 71.85,84.45 C8.2 71.65,86.47 C14.2 | MCU.14 8.51,86.45 4.97,86.45 C6.1 3.52,85 v3.52,84.97 | MCU.2 11.95,97.55 v11.95,98.45 | MCU.7 9.61,94.23 7.31,94.23 v7.15,94.06 5.99,92.9 R3.1 | MCU.44 18.13,98.34 C12.1 23.77,92.8 23.9,92.8 | 52.67,91.45 45.03,83.81 FERRITE_VCC.2 39.95,81.28 39.42,80.75 | 52.67,91.45 52.67,93.67 54.95,95.95 54.98,95.98 | 52.67,91.45 54.95,91.45 56.45,92.95 v58.45,92.95 | C10.1 19.28,80.27 C13.1 | C10.1 18.28,82.17 MCU.24 | C10.1 16.7,80.27 v16.64,80.27 | C13.1 27.61,89.14 C11.1 | v62.97,96.43 62.39,97.01 C15.2 | 39.42,80.75 39.42,66.97 43.66,62.74 v43.66,59.88 43.66,55.11 41.03,52.48 41.03,40.32 v41.75,39.6 41.99,39.37 41.99,33.88 40.8,32.69 40.8,22.25 v40.73,22.19 | 23.9,92.8 C11.1 | MCU.34 23.9,92.8 | 23.9,92.8 C11.1 | 39.42,80.75 39.31,80.86 31.74,80.86 | 31.74,80.86 31.74,84.68 v29.9,86.52 | C13.1 31.15,80.27 31.74,80.86
  Bottom 0.3: v43.66,59.88 43.66,57.81 C19.2 41.3,57.74 UGLOW3.P$1 | v40.73,22.19 41.75,22.19 43.59,20.35 C21.2 43.56,19.62 UGLOW1.P$1 | v41.75,39.6 42.7,39.6 43.66,38.65 43.66,38.17 C20.2 41.23,38.15 UGLOW2.P$1
  Bottom 0.5: v11.95,98.45 10.27,98.45 7.15,95.32 v7.15,94.06 7.15,94.04 14.66,86.52 v29.9,86.52 | v58.45,92.95 59.5,92.95 v62.97,96.43 65.5,98.95 v67.69,98.95 72.6,94.04 v72.6,91.36 72.54,91.3 72.54,85.17 v71.83,84.45 | v16.64,80.27 8.25,80.27 7.67,80.82 v3.52,84.97

### Text on the board
tNames: FERRITE | BOOT | MCU | D+ | LED-DRIVER | D- | ESD | FUSE | ISSI IS31FL3733 | Atmel / Mega 32u4 | MCU CAP / MAIN | FERRITE | Built in a time / when I was / trying to grow
bNames: Awareness16 / rev 1 | KeyboardAtelier@Discord | Stefano Nicolis / Thiird@Github | UNDERGLOW SIG